# EAGLE design mLRS-rx-tx-E77-E22-dual-easysolder-v008 (EAGLE 7.5.0)
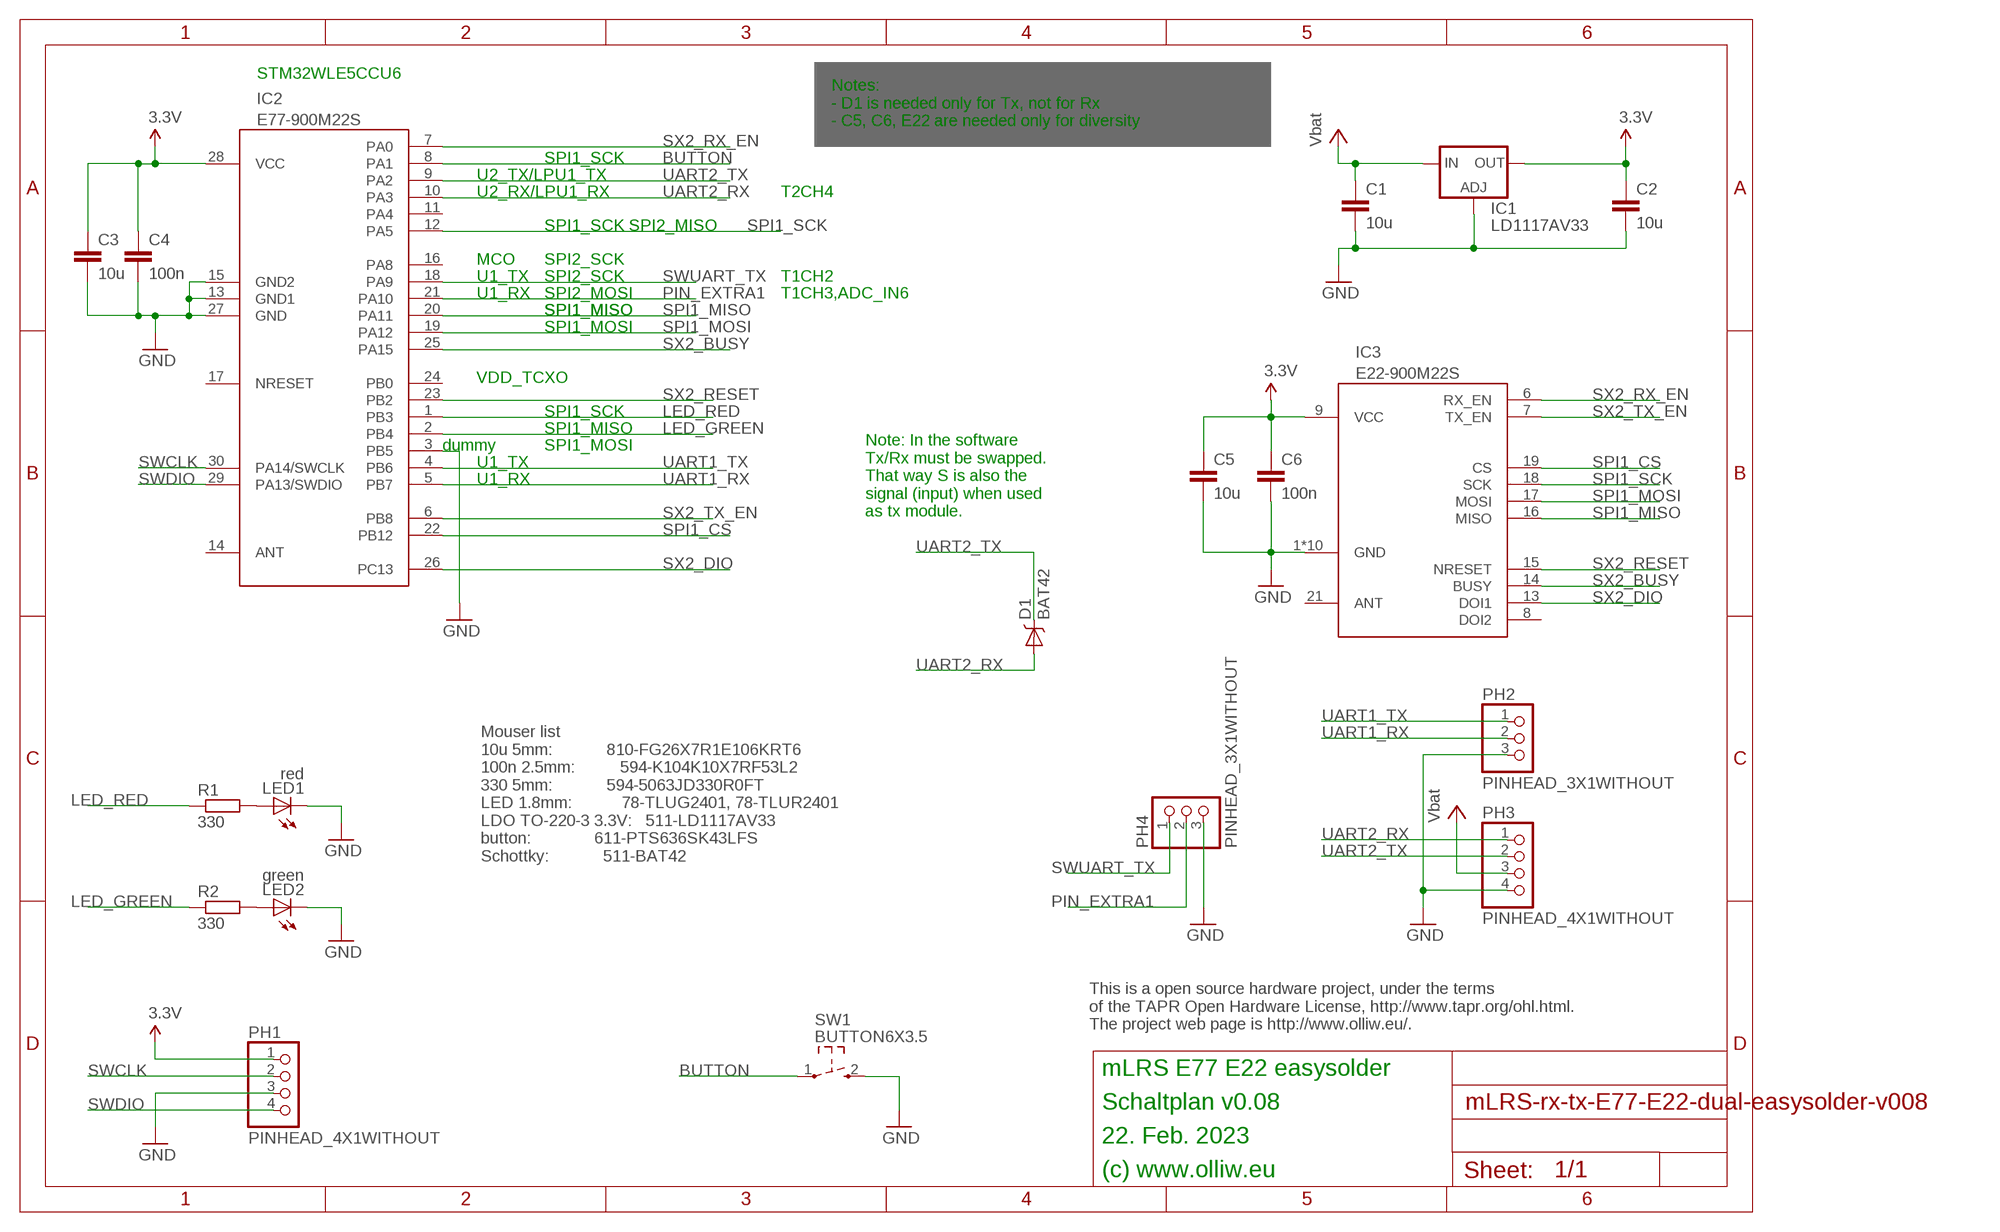
[diagram p0: schematic, sheet 1]

## Parts
C1  10u  C-EU050-045X075  [C050-045X075]
C2  10u  C-EU050-045X075  [C050-045X075]
C3  10u  C-EU050-024X044  [C050-024X044]
C4  100n  C-EU025-024X044  [C025-024X044]
C5  10u  C-EU050-024X044  [C050-024X044]
C6  100n  C-EU025-024X044  [C025-024X044]
D1  BAT42  DIODE-SCHOTTKY7.62MM  [D_7.5]
IC1  LD1117AV33  LD117AV33  [TO220L1]
IC2  E77-900M22S  [E77-900M22S]
IC3  E22-900M22S  [E22-900M22S]
LED1  red  LED1.8MM  [LED1.8MM]
LED2  green  LED1.8MM  [LED1.8MM]
PH1  PINHEAD_4X1WITHOUT  [PINHEAD_4X1_WO]
PH2  PINHEAD_3X1WITHOUT  [PINHEAD_3X1_WO]
PH3  PINHEAD_4X1WITHOUT  [PINHEAD_4X1_WO]
PH4  PINHEAD_3X1WITHOUT  [PINHEAD_3X1_WO]
R1  330  R_EUR0204/6.25  [R0204/6.25]
R2  330  R_EUR0204/6.25  [R0204/6.25]
SW1  BUTTON6X3.5  [BUTTON-THT]

## Nets
3.3V: C2.1 C3.1 C4.1 C5.1 C6.1 IC1.2(OUT) IC2.28(VCC) IC3.9(VCC) PH1.1
BUTTON: IC2.8(PA1) SW1.1
GND: C1.2 C2.2 C3.2 C4.2 C5.2 C6.2 IC1.1(ADJ) IC2.3(PB5) IC2.13(GND1) IC2.15(GND2) IC2.27(GND) IC3.1(GND) IC3.2(GND) IC3.3(GND) IC3.4(GND) IC3.5(GND) IC3.10(GND) IC3.11(GND) IC3.12(GND) IC3.20(GND) IC3.22(GND) LED1.K(C) LED2.K(C) PH1.3 PH2.3 PH3.4 PH4.3 SW1.2
LED_GREEN: IC2.2(PB4) R2.1
LED_RED: IC2.1(PB3) R1.1
N$17: LED1.A R1.2
N$19: LED2.A R2.2
PIN_EXTRA1: IC2.21(PA10) PH4.2
SPI1_CS: IC2.22(PB12) IC3.19(CS)
SPI1_MISO: IC2.20(PA11) IC3.16(MISO)
SPI1_MOSI: IC2.19(PA12) IC3.17(MOSI)
SPI1_SCK: IC2.12(PA5) IC3.18(SCK)
SWCLK: IC2.30(PA14/SWCLK) PH1.2
SWDIO: IC2.29(PA13/SWDIO) PH1.4
SWUART_TX: IC2.18(PA9) PH4.1
SX2_BUSY: IC2.25(PA15) IC3.14(BUSY)
SX2_DIO: IC2.26(PC13) IC3.13(DOI1)
SX2_RESET: IC2.23(PB2) IC3.15(NRESET)
SX2_RX_EN: IC2.7(PA0) IC3.6(RX_EN)
SX2_TX_EN: IC2.6(PB8) IC3.7(TX_EN)
UART1_RX: IC2.5(PB7) PH2.2
UART1_TX: IC2.4(PB6) PH2.1
UART2_RX: D1.A IC2.10(PA3) PH3.1
UART2_TX: D1.C IC2.9(PA2) PH3.2
VCC: C1.1 IC1.3(IN) PH3.3 ; supply symbol labelled Vbat
Unconnected: IC2.11(PA4) IC2.14(ANT) IC2.16(PA8) IC2.17(NRESET) IC2.24(PB0) IC3.8(DOI2) IC3.21(ANT)

## Notes on the sheet
- STM32WLE5CCU6
- Notes:
  - D1 is needed only for Tx, not for Rx
  - C5, C6, E22 are needed only for diversity
- SPI1_SCK
- U2_TX/LPU1_TX
- U2_RX/LPU1_RX | T2CH4
- SPI1_SCK | SPI2_MISO
- MCO | SPI2_SCK
- U1_TX | SPI2_SCK | T1CH2
- U1_RX | SPI2_MOSI | T1CH3,ADC_IN6
- SPI1_MISO | SPI1_MISO
- SPI1_MOSI
- VDD_TCXO
- SPI1_SCK
- SPI1_MISO
- Note: In the software
  Tx/Rx must be swapped.
  That way S is also the
  signal (input) when used
  as tx module.
- dummy | SPI1_MOSI
- U1_TX
- U1_RX
- Mouser list
  10u 5mm:            810-FG26X7R1E106KRT6 
  100n 2.5mm:          594-K104K10X7RF53L2
  330 5mm:            594-5063JD330R0FT 
  LED 1.8mm:           78-TLUG2401, 78-TLUR2401 
  LDO TO-220-3 3.3V:   511-LD1117AV33 
  button:              611-PTS636SK43LFS
  Schottky:            511-BAT42
- This is a open source hardware project, under the terms
  of the TAPR Open Hardware License, http://www.tapr.org/ohl.html.
  The project web page is http://www.olliw.eu/.
- mLRS E77 E22 easysolder
- Schaltplan v0.08
- 22. Feb. 2023
- (c) www.olliw.eu

## Library data of the parts
C1-C6 = rcl:C-EU: CAPACITOR, European symbol
D1 = # stdlib:DIODE-SCHOTTKY
IC1 = v-reg:LD117A?*: Low drop fixed and adjustable positive voltage regulators 1 A Source: http://www.st.com/stonline/products/literature/ds/7194/ld1117axx.pdf
IC2 = # stdlib:E77-900M22S
IC3 = # stdlib:E22-900M22S
LED1 LED2 = # stdlib:LED
PH1 PH3 = # stdlib:PINHEAD_4X1
PH2 PH4 = # stdlib:PINHEAD_3X1
R1 R2 = # stdlib:R_EU
SW1 = # stdlib:BUTTON

## Board
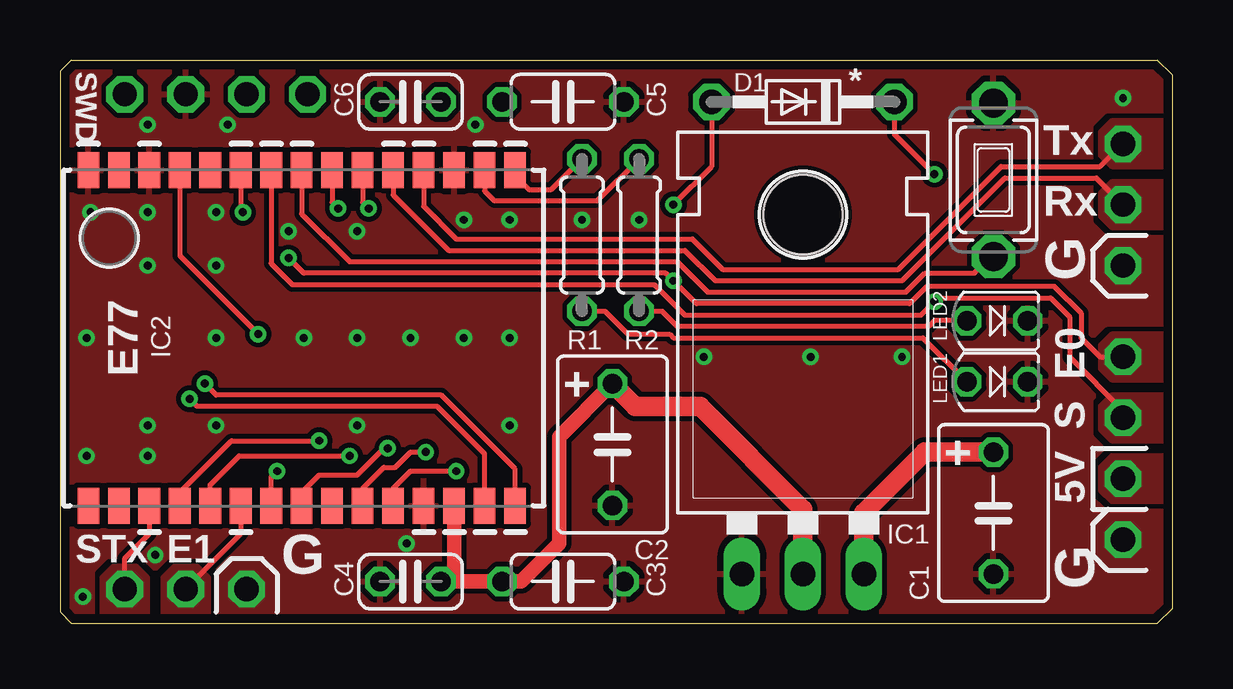
[diagram p1: board, top side]
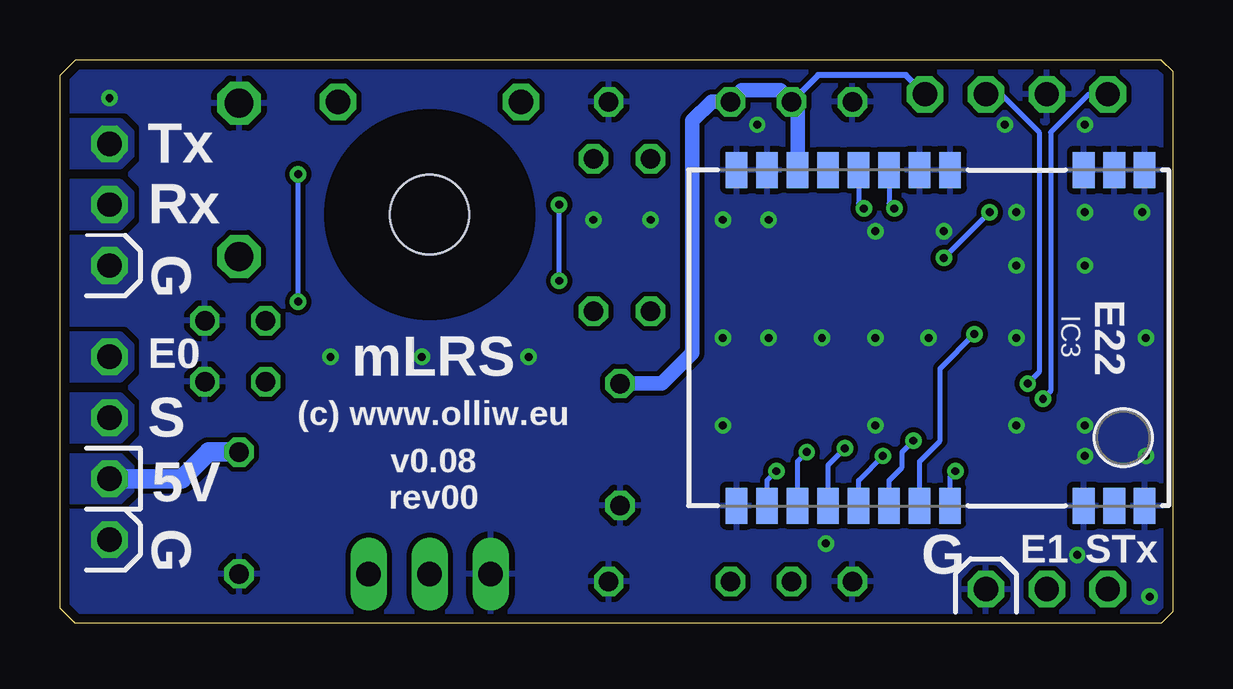
[diagram p2: board, bottom side, seen from below]

Size 46.35 x 23.5 mm. Coordinates in mm from the lower left corner, seen from the top.
Outline: 45.72,0 46.35,0.64 46.35,22.86 45.72,23.5 0.48,23.5 0,23.02 0,0.48 0.48,0 45.72,0
Copper layers (1*16): Top 0.0356mm / dielectric 1.5011mm / Bottom 0.0356mm
Design rules "ow-oshpark-2layer": minimum track width 6mil, minimum drill 13mil, track to track 6mil, track to pad 6mil, pad to pad 6mil, via to via 6mil, smd to smd 6mil, copper to edge 15mil, drill to drill 6mil, minimum pad ring 7mil, minimum via ring 7mil, stop-mask expansion 2.5mil, vias tented up to drill 26mil, thermal gap 10mil

### Footprints (pad centres in the part's own frame; a part is rotated, then mirrored left to right if it is on the bottom)
C050-045X075 = drill 0.813 octagon: 1 -2.54,0; 2 2.54,0
C050-024X044 = drill 0.813 octagon: 1 -2.54,0; 2 2.54,0
C025-024X044 = drill 0.813 octagon: 1 -1.27,0; 2 1.27,0
D_7.5 = drill 1.016 octagon: A 3.81,0; C -3.81,0
TO220L1 = drill 1.016 long: 1 -2.54,-3.81; 2 0,-3.81; 3 2.54,-3.81 | hole 3.302: 0,11.176
E77-900M22S = smd 1.5 x 0.9: 1 -7,8.8; 2 -7,7.53; 3 -7,6.26; 4 -7,4.99; 5 -7,3.72; 6 -7,2.45; 7 -7,1.18; 8 -7,-0.09; 9 -7,-1.36; 10 -7,-2.63; 11 -7,-3.9; 12 -7,-5.17; 13 -7,-6.44; 14 -7,-7.71; 15 -7,-8.98; 16 7,-8.98; 17 7,-7.71; 18 7,-6.44; 19 7,-5.17; 20 7,-3.9; 21 7,-2.63; 22 7,-1.36; 23 7,-0.09; 24 7,1.18; 25 7,2.45; 26 7,3.72; 27 7,4.99; 28 7,6.26; 29 7,7.53; 30 7,8.8
E22-900M22S = smd 1.5 x 0.9: 1 -7,9; 2 -7,7.73; 3 -7,6.46; 4 -7,0.89; 5 -7,-0.38; 6 -7,-1.65; 7 -7,-2.92; 8 -7,-4.19; 9 -7,-5.46; 10 -7,-6.73; 11 -7,-8; 12 7,-8; 13 7,-6.73; 14 7,-5.46; 15 7,-4.19; 16 7,-2.92; 17 7,-1.65; 18 7,-0.38; 19 7,0.89; 20 7,6.46; 21 7,7.73; 22 7,9
LED1.8MM = drill 0.813 octagon: A -1.27,0; K 1.27,0
PINHEAD_4X1_WO = drill 1.016 octagon: 1 0,0; 2 0,-2.54; 3 0,-5.08; 4 0,-7.62
PINHEAD_3X1_WO = drill 1.016 octagon: 1 0,0; 2 0,-2.54; 3 0,-5.08
R0204/6.25 = drill 0.813 octagon: 1 -3.175,0; 2 3.175,0
BUTTON-THT = drill 1.2 octagon: 1 -3.2,0; 2 3.2,0

### Placement (x,y rotation side)
C1  38.89,4.6 270 top
C2  23.02,7.46 270 top
C3  20.96,1.75 0 top
C4  14.61,1.75 180 top
C5  20.96,21.75 0 top
C6  14.61,21.75 180 top
D1  30.96,21.75 180 top
IC1  30.96,5.87 0 top
IC2  10.16,11.91 270 top
IC3  10.16,11.91 270 bottom
LED1  39.05,10.08 0 top
LED2  39.05,12.62 0 top
PH1  10.32,22.07 270 top
PH2  44.29,20 0 top
PH3  44.29,11.11 0 top
PH4  2.7,1.43 90 top
R1  21.75,16.19 270 top
R2  24.13,16.19 270 top
SW1  38.89,18.49 90 top

### Tracks (layer width: path | path; a pad name or v marks a point on that pad's centre or on a via)
3.3V
  Top 0.61: C4.1 16.35,1.75 16.42,1.81 | IC2.28 16.42,1.81 | C2.1 20.8,7.78 20.8,3.33 19.21,1.75 C3.1 16.49,1.75 16.42,1.81
  Top 0.813: C2.1 23.97,9.05 26.67,9.05 30.96,4.76 IC1.2
  Bottom 0.254: PH1.1 11.11,22.86 14.76,22.86 C6.1
  Bottom 0.61: IC3.9 15.62,21.49 C6.1 16.35,22.23 17.94,22.23 C5.1 19.21,21.75 20,20.95 20,11.27 21.27,10 C2.1
BUTTON  (1 unrouted)
  Top 0.203: 10.14,18.91 10.16,18.89 | IC2.8 10.07,17.08 12.07,15.08 25.72,15.08 26.99,13.81 35.24,13.81 36.04,14.61 38.1,14.61 38.87,15.37 SW1.1
GND  (via drill 0.33)
  other vias: 44.29,21.91 1.11,11.91 0.95,1.11 14.45,3.33 1.27,17.14 3.65,17.14 6.51,17.14 3.65,20.8 16.83,16.83 18.73,16.83 21.75,16.83 24.13,16.83 17.3,20.8 6.51,11.91 10.16,11.91 12.38,11.91 14.61,11.91 16.83,11.91 18.73,11.91 12.38,8.26 6.51,8.26 1.11,6.99 18.73,8.26 26.83,11.11 35.08,11.11 31.27,11.11 12.38,16.35 9.53,16.35 6.51,14.92 3.65,14.92 3.65,8.26 6.99,20.8 3.65,6.99 3.97,2.86
  pour Bottom (isolate 0.203, rank 6): 0.16,23.34 46.04,23.34 46.04,0.16 0.16,0.16
  pour Top (isolate 0.203, rank 6): 0.16,23.34 46.04,23.34 46.04,0.16 0.16,0.16
  pour Top (no thermals): 46.04,15.88 43.81,15.88 43.34,15.4 43.34,14.45 43.81,13.97 46.04,13.97
  pour Top (no thermals): 46.04,4.45 43.81,4.45 43.34,3.97 43.34,3.02 43.81,2.54 46.04,2.54
  pour Bottom (no thermals): 46.04,13.97 43.81,13.97 43.34,14.45 43.34,15.4 43.81,15.88 46.04,15.88
  pour Bottom (no thermals): 46.04,2.54 43.81,2.54 43.34,3.02 43.34,3.97 43.81,4.45 46.04,4.45
  pour Top (no thermals): 8.73,0.32 8.73,1.91 8.26,2.38 7.3,2.38 6.83,1.91 6.83,0.32
LED_GREEN
  Top 0.203: R2.1 22.38,17.62 18.1,17.62 17.69,18.03 IC2.2
LED_RED
  Top 0.203: IC2.1 18.96,18.66 19.53,18.1 20.48,18.1 R1.1
N$17
  Top 0.203: R1.2 22.7,13.02 23.65,12.06 25.4,12.06 25.56,11.91 35.96,11.91 LED1.A
N$19
  Top 0.203: LED2.A 36.43,12.62 36.2,12.38 25.72,12.38 25.08,13.02 R2.2
PIN_EXTRA1
  Top 0.203: IC2.21 7.53,3.74 5.38,1.59 PH4.2
  pour Top (no thermals): 6.19,0.32 6.19,1.91 5.71,2.38 4.76,2.38 4.29,1.91 4.29,0.32
SPI1_CS  (via drill 0.33)
  Top 0.203: IC2.22 8.8,6.1 v9.05,6.35
  Bottom 0.203: IC3.19 9.27,6.13 v9.05,6.35
SPI1_MISO  (via drill 0.33)
  Top 0.203: IC2.20 6.26,5.78 7.46,6.99 v12.07,6.99
  Bottom 0.203: IC3.16 13.08,5.97 v12.07,6.99
SPI1_MOSI  (via drill 0.33)
  Top 0.203: IC2.19 4.99,5.47 7.14,7.62 v10.79,7.62
  Bottom 0.203: IC3.17 11.81,5.97 11.27,6.51 11.27,7.14 v10.79,7.62
SPI1_SCK  (via drill 0.33)
  Top 0.203: IC2.12 4.99,15.33 v8.26,12.06
  Bottom 0.203: IC3.18 10.54,6.76 9.68,7.62 9.68,10.64 v8.26,12.06
SWCLK  (via drill 0.33)
  Top 0.203: IC2.30 18.96,6.44 15.88,9.53 6.51,9.53 v6.03,10
  Bottom 0.203: PH1.2 7.14,22.07 5.56,20.48 5.56,10.48 v6.03,10
SWDIO  (via drill 0.33)
  Top 0.203: IC2.29 17.69,7.08 15.72,9.05 5.71,9.05 v5.4,9.37
  Bottom 0.203: PH1.4 3.49,22.07 5.08,20.48 5.08,9.68 v5.4,9.37
SWUART_TX
  Top 0.203: IC2.18 3.72,3.74 2.7,2.72 PH4.1
  pour Top (no thermals): 3.65,0.32 3.65,1.91 3.18,2.38 2.22,2.38 1.75,1.91 1.75,0.32
SX2_BUSY  (via drill 0.33)
  Top 0.203: v15.24,7.14 14.61,7.14 13.97,6.51 13.49,6.51 12.61,5.62 IC2.25
  Bottom 0.203: IC3.14 15.62,6.76 v15.24,7.14
SX2_DIO  (via drill 0.33)
  Top 0.203: v16.51,6.35 14.61,6.35 13.88,5.62 IC2.26
  Bottom 0.203: IC3.13 16.89,5.97 v16.51,6.35
SX2_RESET  (via drill 0.33)
  Top 0.203: v13.65,7.3 13.49,7.3 12.38,6.19 10.79,6.19 10.07,5.47 IC2.23
  Bottom 0.203: IC3.15 14.35,6.61 v13.65,7.3
SX2_RX_EN  (via drill 0.33)
  Top 0.203: IC2.7 11.34,17.55 v11.59,17.3
  Bottom 0.203: IC3.6 11.81,17.52 v11.59,17.3
SX2_TX_EN  (via drill 0.33)
  Top 0.203: IC2.6 12.61,17.55 v12.86,17.3
  Bottom 0.203: IC3.7 13.08,17.52 v12.86,17.3
UART1_RX
  Top 0.203: IC2.5 13.88,17.87 16.19,15.56 26.04,15.56 27.3,14.29 35.08,14.29 39.37,18.57 43.18,18.57 PH2.2
  pour Top (no thermals): 46.04,18.41 43.81,18.41 43.34,17.94 43.34,16.99 43.81,16.51 46.04,16.51
  pour Bottom (no thermals): 46.04,16.51 43.81,16.51 43.34,16.99 43.34,17.94 43.81,18.41 46.04,18.41
UART1_TX
  Top 0.203: PH2.1 43.34,19.05 39.21,19.05 34.92,14.76 27.62,14.76 26.35,16.03 16.51,16.03 15.15,17.39 IC2.4
  pour Top (no thermals): 43.81,20.95 43.34,20.48 43.34,19.53 43.81,19.05 46.04,19.05 46.04,20.95
  pour Bottom (no thermals): 46.04,19.05 43.81,19.05 43.34,19.53 43.34,20.48 43.81,20.95 46.04,20.95
UART2_RX  (via drill 0.33)
  Top 0.203: IC2.10 7.53,17.23 v7.62,17.14 | v9.53,15.24 10.16,14.61 25.24,14.61 v25.56,14.29 26.51,13.34 35.4,13.34 36.12,14.05 41.43,14.05 42.54,12.94 42.54,11.91 43.34,11.11 PH3.1 | v25.56,17.46 27.15,19.05 D1.A
  Bottom 0.203: v7.62,17.14 v9.53,15.24 | v25.56,14.29 v25.56,17.46
  pour Top (no thermals): 46.04,12.06 43.81,12.06 43.34,11.59 43.34,10.64 43.81,10.16 46.04,10.16
  pour Bottom (no thermals): 46.04,10.16 43.81,10.16 43.34,10.64 43.34,11.59 43.81,12.06 46.04,12.06
UART2_TX  (via drill 0.33)
  Top 0.203: IC2.9 8.8,15.01 9.68,14.13 24.77,14.13 26.04,12.86 35.88,12.86 v36.43,13.41 36.59,13.57 41.27,13.57 42.07,12.78 42.07,11.11 44.29,8.89 PH3.2 | v36.43,18.73 34.77,20.4 D1.C
  Bottom 0.203: v36.43,13.41 v36.43,18.73
  pour Top (no thermals): 46.04,9.53 43.81,9.53 43.34,9.05 43.34,8.1 43.81,7.62 46.04,7.62
  pour Bottom (no thermals): 46.04,7.62 43.81,7.62 43.34,8.1 43.34,9.05 43.81,9.53 46.04,9.53
VCC
  Top 0.813: IC1.3 33.5,4.6 36.04,7.14 C1.1
  Bottom 0.813: PH3.3 41.27,6.03 40.16,7.14 C1.1
  pour Top (no thermals): 46.04,6.99 43.81,6.99 43.34,6.51 43.34,5.56 43.81,5.08 46.04,5.08
  pour Bottom (no thermals): 46.04,5.08 43.81,5.08 43.34,5.56 43.34,6.51 43.81,6.99 46.04,6.99

### Text on the board
tNames: SWD | * | Tx | Rx | G | E77 | E0 | + | S | + | 5V | STx | E1 | G | G
bNames: Tx | Rx | G | E22 | E0 | mLRS | (c) www.olliw.eu | S | v0.08 / rev00 | 5V | G | STx | E1 | G